# Altium schematic sheet Linear_Voltage_Regulator[Fixed].SchDoc
size A; SheetNumber: 2; SheetTotal: 3
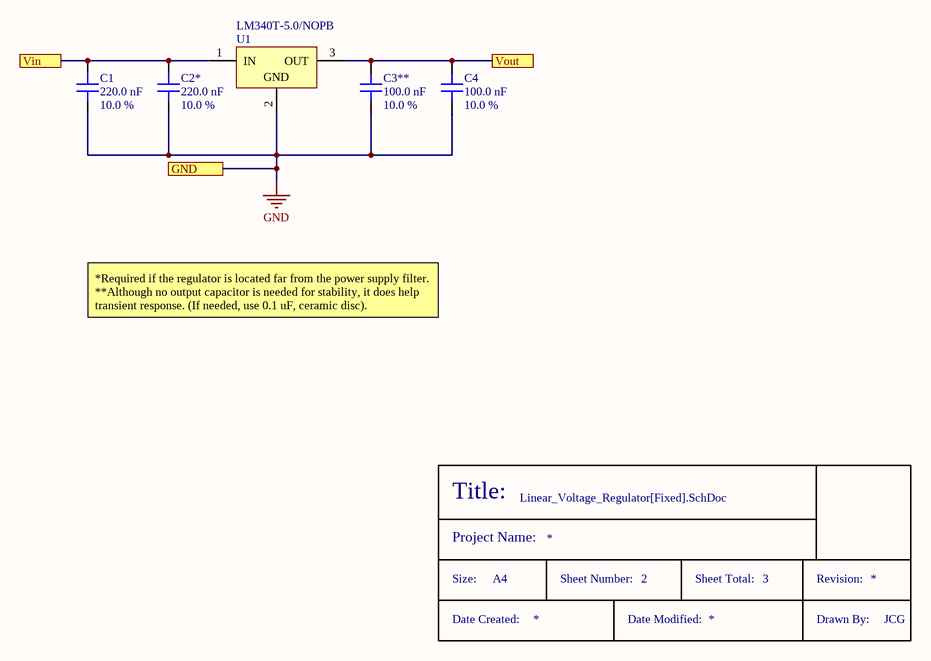
[diagram p0: Linear_Voltage_Regulator[Fixed].SchDoc]

## Parts
*  Title_Block  (value not drawn)
C1  220.0 nF  Tolerance: 10.0 %  [PCB - CAPACITOR - MLCC - CAP 0_2 RADIAL DISC]
C2*  220.0 nF  Tolerance: 10.0 %  [PCB - CAPACITOR - MLCC - CAP 0_2 RADIAL DISC]
C3**  100.0 nF  Tolerance: 10.0 %  [PCB - CAPACITOR - MLCC - CAP 0_2 RADIAL DISC]
C4  100.0 nF  Tolerance: 10.0 %  [PCB - CAPACITOR - MLCC - CAP 0_2 RADIAL DISC]
U1  LM340T-5.0/NOPB  [NDE0003A]

## Ports
GND, Vin, Vout

## Nets
GND: C1.2 C2*.2 C3**.2 C4.2 U1.2(GND) ; port GND
Vin: C1.1 C2*.1 U1.1(IN) ; port Vin
Vout: C3**.1 C4.1 U1.3(OUT) ; port Vout

## Notes on the sheet
- *Required if the regulator is located far from the power supply filter. **Although no output capacitor is needed for stability, it does help transient response. (If needed, use 0.1 uF, ceramic disc).
- (in symbol Title_Block) Title:; Project Name:; Size:; A4; Sheet Number:; Sheet Total:; Revision:; Date Created:; Date Modified:; Drawn By:; JCG

## Library data of the parts
C1 C2* = 558: 0.22µF ±10% 50V Ceramic Capacitor X8L Radial; Rowan Part Number: 558; Manufacturer: KEMET; Manufacturer part number: C317C224K5N5TA91707301; Name: 220.0 nF 50.0 V 10.0 % Ceramic Capacitor; Voltage Rating: 50.0 V; Supplier 1: Digi-Key; Supplier Part Number 1: 399-14392-1-ND; Category: Capacitors; Datasheet: https://api.kemet.com/component-edge/download/datasheet/C317C224K5N5TA91707301.pdf; Status: Active; Capacitance: 220.0 nF; Composition: Ceramic; Packaging: Cut Tape (CT); Package: Radial
C3** C4 = 1340: 0.1µF ±10% 50V Ceramic Capacitor X7R Radial; Rowan Part Number: 1340; Manufacturer: Vishay Beyschlag/Draloric/BC Components; Manufacturer part number: K104K15X7RF53H5; Name: 100.0 nF 50.0 V 10.0 % Ceramic Capacitor; Voltage Rating: 50.0 V; Supplier 1: Digi-Key; Supplier Part Number 1: BC3323-ND; Category: Capacitors; Datasheet: https://www.vishay.com/docs/45171/kseries.pdf; Status: Active; Capacitance: 100.0 nF; Composition: Ceramic; Packaging: Bulk; Package: Radial
U1 = CMP-0062-02433-3: Series 3-Terminal Positive Regulators, 3-pin TO-220, Pb-Free; Manufacturer: Texas Instruments; PackageTopMarking: NSUZXYTTE#*LM340T5*7805 P+; PowerWise: N; CompType: LDO IC; RoHS: Y; PackageReference: NDE0003A; PackageDescription: TO-220, Molded, 3 Lead, Straight; ComponentLink1Description: Datasheet URL; ComponentLink1URL: http://www.ti.com/general/docs/lit/getliterature.tsp?genericPartNumber=LM340-N&fileType=pdf; PinCount: 3